# Altium schematic sheet 08_SAMA7G54-MPU.SchDoc
size 420 x 297 mm; SheetNumber: 13; SheetTotal: 36
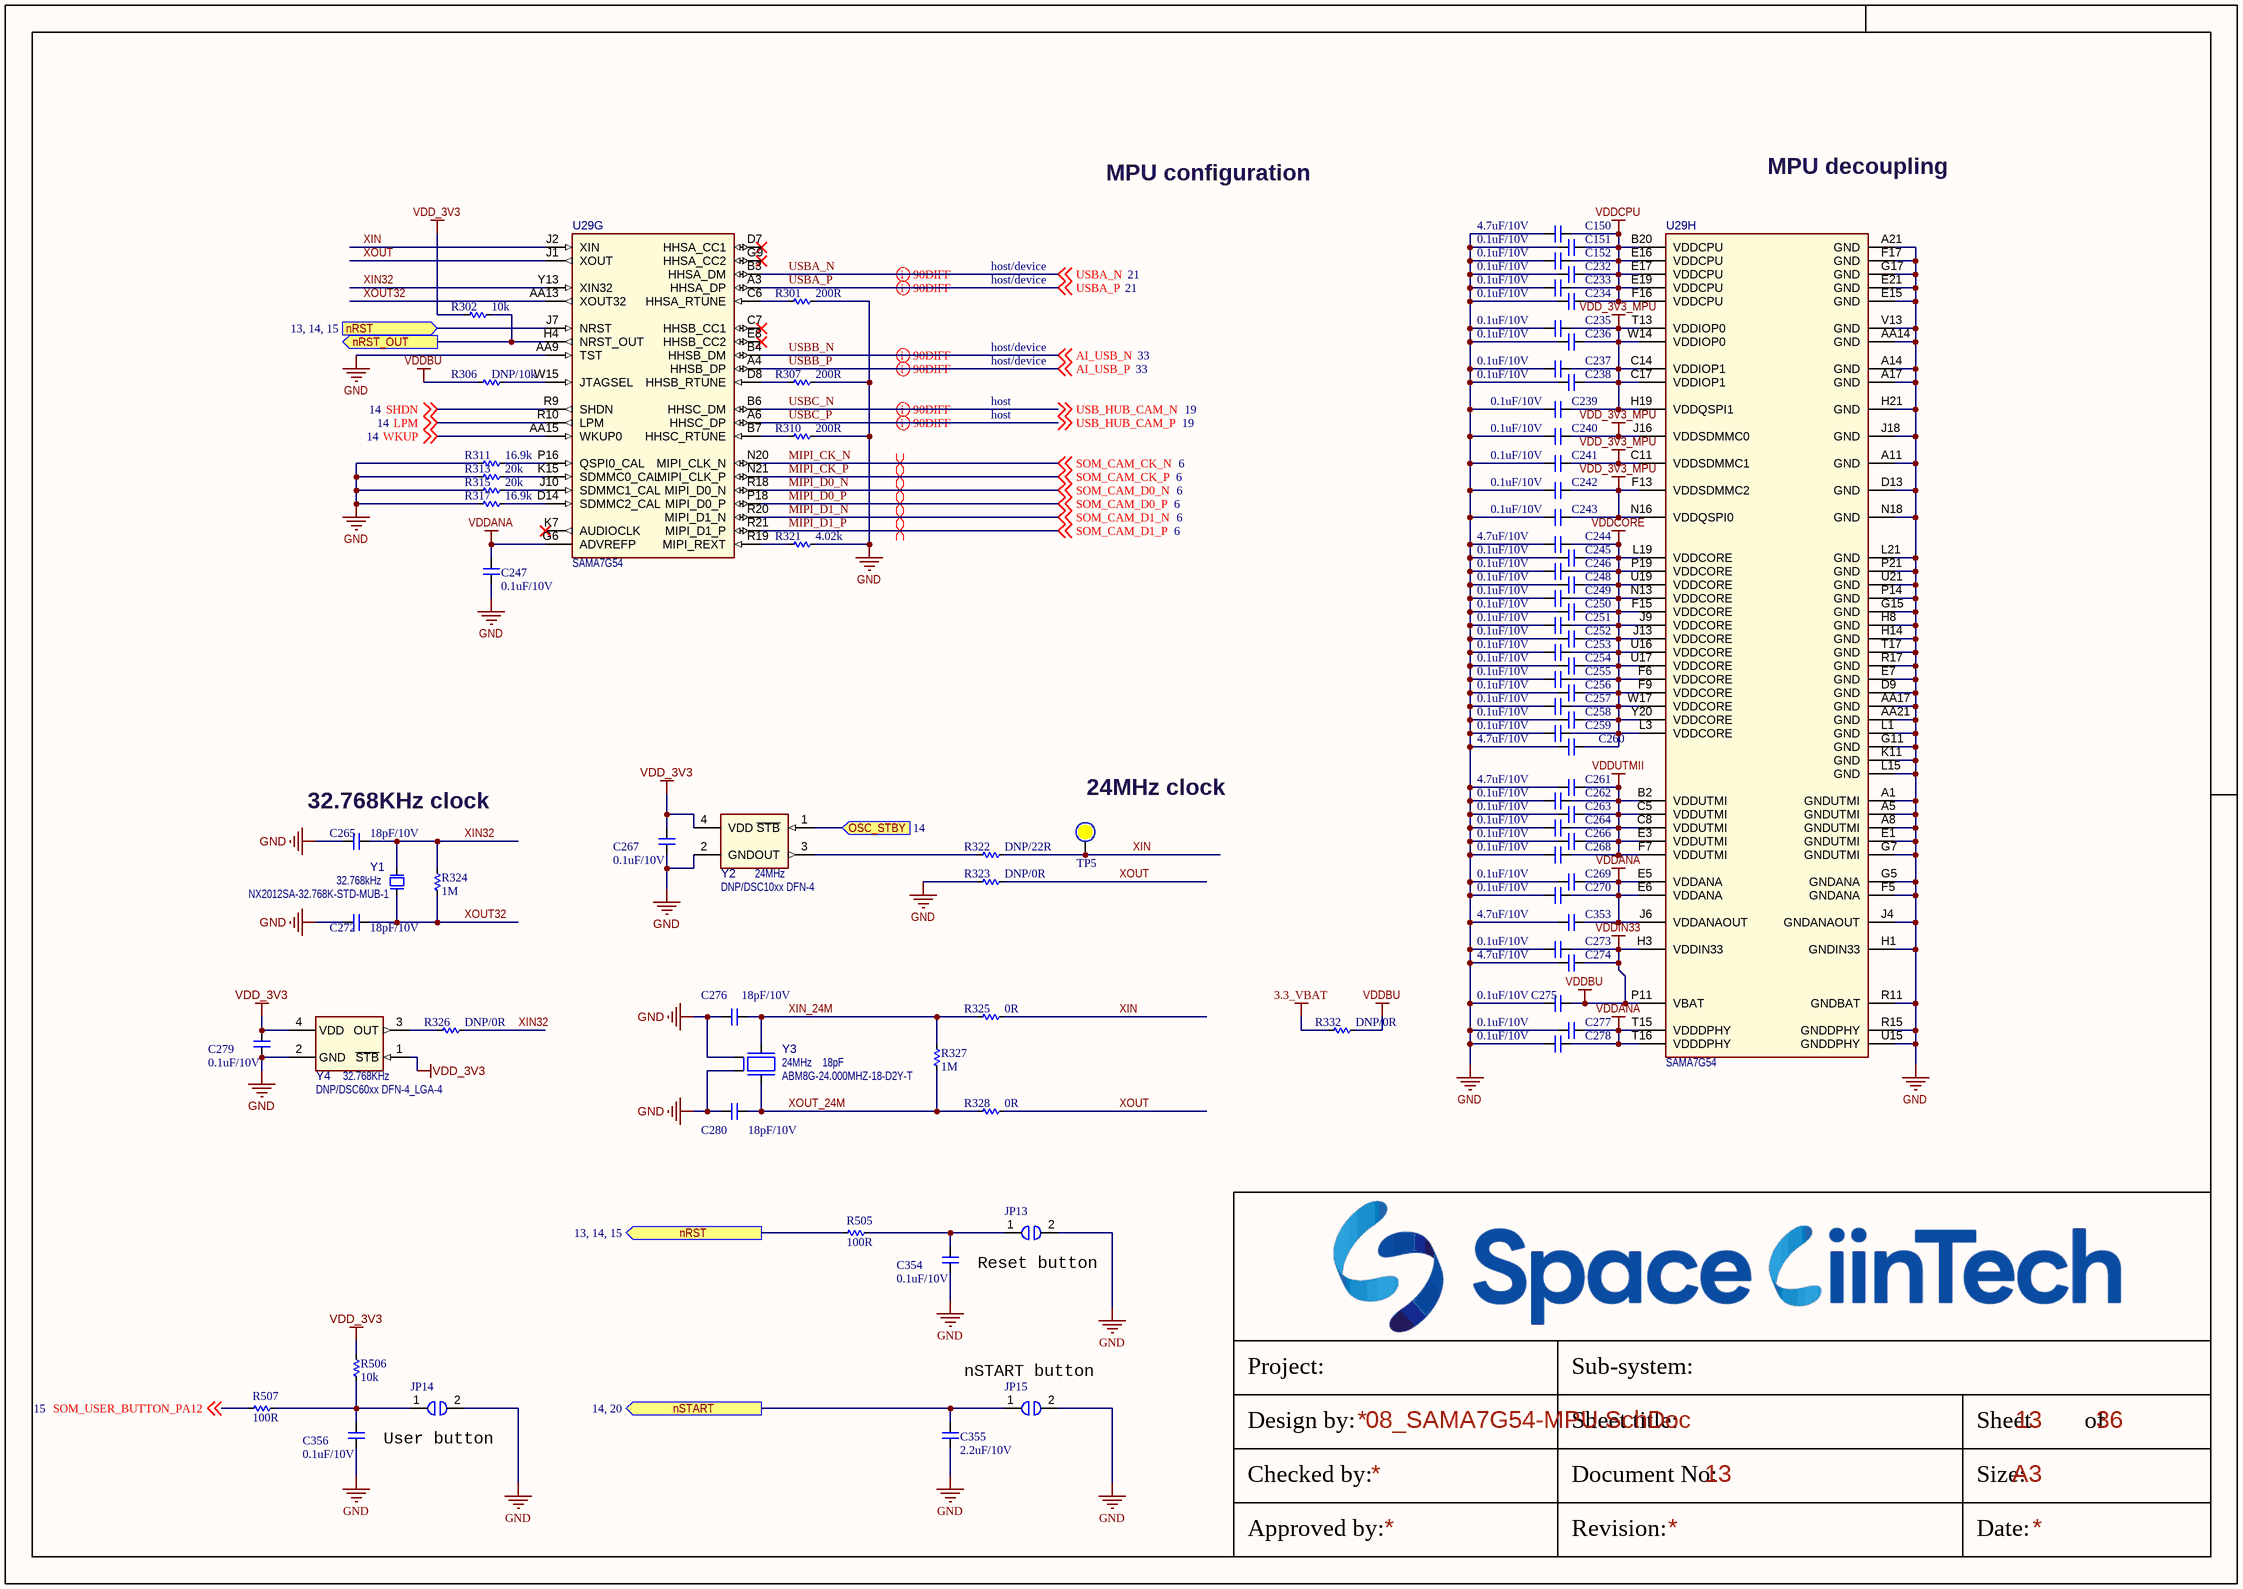
[diagram p0: 08_SAMA7G54-MPU.SchDoc]

## Parts
C150  4.7uF/10V  [CAP_C_1005X50_L]
C151  0.1uF/10V  [CAP_C_0603x30]
C152  0.1uF/10V  [CAP_C_0603x30]
C232  0.1uF/10V  [CAP_C_0603x30]
C233  0.1uF/10V  [CAP_C_0603x30]
C234  0.1uF/10V  [CAP_C_0603x30]
C235  0.1uF/10V  [CAP_C_0603x30]
C236  0.1uF/10V  [CAP_C_0603x30]
C237  0.1uF/10V  [CAP_C_0603x30]
C238  0.1uF/10V  [CAP_C_0603x30]
C239  0.1uF/10V  [CAP_C_0603x30]
C240  0.1uF/10V  [CAP_C_0603x30]
C241  0.1uF/10V  [CAP_C_0603x30]
C242  0.1uF/10V  [CAP_C_0603x30]
C243  0.1uF/10V  [CAP_C_0603x30]
C244  4.7uF/10V  [CAP_C_1005X50_L]
C245  0.1uF/10V  [CAP_C_0603x30]
C246  0.1uF/10V  [CAP_C_0603x30]
C247  0.1uF/10V  [CAP_C_0603x30]
C248  0.1uF/10V  [CAP_C_0603x30]
C249  0.1uF/10V  [CAP_C_0603x30]
C250  0.1uF/10V  [CAP_C_0603x30]
C251  0.1uF/10V  [CAP_C_0603x30]
C252  0.1uF/10V  [CAP_C_0603x30]
C253  0.1uF/10V  [CAP_C_0603x30]
C254  0.1uF/10V  [CAP_C_0603x30]
C255  0.1uF/10V  [CAP_C_0603x30]
C256  0.1uF/10V  [CAP_C_0603x30]
C257  0.1uF/10V  [CAP_C_0603x30]
C258  0.1uF/10V  [CAP_C_0603x30]
C259  0.1uF/10V  [CAP_C_0603x30]
C260  4.7uF/10V  [CAP_C_1005X50_L]
C261  4.7uF/10V  [CAP_C_1005X50_L]
C262  0.1uF/10V  [CAP_C_0603x30]
C263  0.1uF/10V  [CAP_C_0603x30]
C264  0.1uF/10V  [CAP_C_0603x30]
C265  18pF/10V  [CAP_C_1005X60]
C266  0.1uF/10V  [CAP_C_0603x30]
C267  0.1uF/10V  [CAP_C_1005X60]
C268  0.1uF/10V  [CAP_C_0603x30]
C269  0.1uF/10V  [CAP_C_0603x30]
C270  0.1uF/10V  [CAP_C_0603x30]
C272  18pF/10V  [CAP_C_1005X60]
C273  0.1uF/10V  [CAP_C_0603x30]
C274  4.7uF/10V  [CAP_C_1005X50_L]
C275  0.1uF/10V  [CAP_C_0603x30]
C276  18pF/10V  [CAP_C_1005X60]
C277  0.1uF/10V  [CAP_C_0603x30]
C278  0.1uF/10V  [CAP_C_0603x30]
C279  0.1uF/10V  [CAP_C_1005X60]
C280  18pF/10V  [CAP_C_1005X60]
C353  4.7uF/10V  [CAP_C_1005X50_L]
C354  0.1uF/10V  [CAP_C_1005X60]
C355  2.2uF/10V  [CAP_C_1005X60]
C356  0.1uF/10V  [CAP_C_1005X60]
JP13  (no value)  [TESTPOINT_SHORT_120X100_60]
JP14  (no value)  [TESTPOINT_SHORT_120X100_60]
JP15  (no value)  [TESTPOINT_SHORT_120X100_60]
R301  200R  [RES_C_0603X30]
R302  10k  [RES_C_1005X40]
R306  DNP/10k  [RES_C_0603X30]
R307  200R  [RES_C_0603X30]
R310  200R  [RES_C_0603X30]
R311  16.9k  [RES_C_0603X30]
R313  20k  [RES_C_1005X40]
R315  20k  [RES_C_0603X30]
R317  16.9k  [RES_C_0603X30]
R321  4.02k  [RES_C_1005X40]
R322  DNP/22R  [RES_C_1005X40]
R323  DNP/0R  [RES_C_1005X40]
R324  1M  [RES_C_1005X40]
R325  0R  [RES_C_1005X40]
R326  DNP/0R  [RES_C_1005X40]
R327  1M  [RES_C_1005X40]
R328  0R  [RES_C_1005X40]
R332  DNP/0R  [RES_C_1005X40]
R505  100R  [RES_C_1005X40]
R506  10k  [RES_C_1005X40]
R507  100R  [RES_C_1005X40]
TP5  (no value)  [Testpoint_80]  (no BOM)
U29  SAMA7G54  [TFBGA-343_14x14 - 2.5mm]  (parts G,H of 8)
Y1  value 32.768kHz  Manufacturer Part Number 1: NX2012SA-32.768K-STD-MUB-1  [CRYSTAL_NX2012SA]  (hidden comment: Crystal 2 Pins)
Y2  DNP/DSC10xx DFN-4  value 24MHz  [DFN-4_2.5x2]
Y3  value 24MHz  Load Capacitance: 18pF  Manufacturer Part Number 1: ABM8G-24.000MHZ-18-D2Y-T  [CRYSTAL_ABM8G]  (hidden comment: Crystal 4 Pins)
Y4  DNP/DSC60xx DFN-4_LGA-4  value 32.768KHz  [DFN-4_2x1.6]

## Ports
nRST (in, see 13, 14, 15), nRST (out, see 13, 14, 15), nRST_OUT (out), nSTART (out, see 14, 20), OSC_STBY (in, see 14)

## Nets
3.3_VBAT: R332.1
GND: C150.2 C151.2 C152.2 C232.2 C233.2 C234.2 C235.2 C236.2 C237.2 C238.2 C239.2 C240.2 C241.2 C242.2 C243.2 C244.2 C245.2 C246.2 C247.1 C248.2 C249.2 C250.2 C251.2 C252.2 C253.2 C254.2 C255.2 C256.2 C257.2 C258.2 C259.2 C260.2 C261.2 C262.2 C263.2 C264.2 C265.2 C266.2 C267.1 C268.2 C269.2 C270.2 C272.2 C273.2 C274.2 C275.2 C276.2 C277.2 C278.2 C279.1 C280.2 C353.2 C354.1 C355.2 C356.1 JP13.2 JP14.2 JP15.2 R301.1 R307.1 R310.1 R311.2 R313.2 R315.2 R317.2 R321.1 R323.1 U29.A1(GNDUTMI) U29.A5(GNDUTMI) U29.A8(GNDUTMI) U29.A11(GND) U29.A14(GND) U29.A17(GND) U29.A21(GND) U29.AA9(TST) U29.AA14(GND) U29.AA17(GND) U29.AA21(GND) U29.D9(GND) U29.D13(GND) U29.E1(GNDUTMI) U29.E7(GND) U29.E15(GND) U29.E21(GND) U29.F5(GNDANA) U29.F17(GND) U29.G5(GNDANA) U29.G7(GNDUTMI) U29.G11(GND) U29.G15(GND) U29.G17(GND) U29.H1(GNDIN33) U29.H8(GND) U29.H14(GND) U29.H21(GND) U29.J4(GNDANAOUT) U29.J18(GND) U29.K11(GND) U29.L1(GND) U29.L15(GND) U29.L21(GND) U29.N18(GND) U29.P14(GND) U29.P21(GND) U29.R11(GNDBAT) U29.R15(GNDDPHY) U29.R17(GND) U29.T17(GND) U29.U15(GNDDPHY) U29.U21(GND) U29.V13(GND) Y2.2(GND) Y3.2(GND) Y3.4(GND) Y4.2(GND)
VDD_3V3: C267.2 C279.2 R302.2 R506.2 Y2.4(VDD) Y4.1(~{STB}) Y4.4(VDD)
VDD_3V3_MPU: C235.1 C236.1 C237.1 C238.1 C239.1 C240.1 C241.1 C242.1 C243.1 U29.C11(VDDSDMMC1) U29.C14(VDDIOP1) U29.C17(VDDIOP1) U29.F13(VDDSDMMC2) U29.H19(VDDQSPI1) U29.J16(VDDSDMMC0) U29.N16(VDDQSPI0) U29.T13(VDDIOP0) U29.W14(VDDIOP0)
VDDANA: C247.2 C269.1 C270.1 C277.1 C278.1 C353.1 U29.E5(VDDANA) U29.E6(VDDANA) U29.G6(ADVREFP) U29.J6(VDDANAOUT) U29.T15(VDDDPHY) U29.T16(VDDDPHY)
VDDBU: C273.1 C274.1 C275.1 R306.2 R332.2 U29.H3(VDDIN33) U29.P11(VBAT)  [also labelled VDDIN33]
VDDCORE: C244.1 C245.1 C246.1 C248.1 C249.1 C250.1 C251.1 C252.1 C253.1 C254.1 C255.1 C256.1 C257.1 C258.1 C259.1 C260.1 U29.F6(VDDCORE) U29.F9(VDDCORE) U29.F15(VDDCORE) U29.J9(VDDCORE) U29.J13(VDDCORE) U29.L3(VDDCORE) U29.L19(VDDCORE) U29.N13(VDDCORE) U29.P19(VDDCORE) U29.U16(VDDCORE) U29.U17(VDDCORE) U29.U19(VDDCORE) U29.W17(VDDCORE) U29.Y20(VDDCORE)
VDDCPU: C150.1 C151.1 C152.1 C232.1 C233.1 C234.1 U29.B20(VDDCPU) U29.E16(VDDCPU) U29.E17(VDDCPU) U29.E19(VDDCPU) U29.F16(VDDCPU)
VDDUTMII: C261.1 C262.1 C263.1 C264.1 C266.1 C268.1 U29.B2(VDDUTMI) U29.C5(VDDUTMI) U29.C8(VDDUTMI) U29.E3(VDDUTMI) U29.F7(VDDUTMI)
LPM: U29.R10(LPM) ; off-sheet LPM
MIPI_CK_N: U29.N20(MIPI_CLK_N) ; off-sheet SOM_CAM_CK_N  [also labelled SOM_CAM_CK_N]
MIPI_CK_P: U29.N21(MIPI_CLK_P) ; off-sheet SOM_CAM_CK_P  [also labelled SOM_CAM_CK_P]
MIPI_D0_N: U29.R18(MIPI_D0_N) ; off-sheet SOM_CAM_D0_N  [also labelled SOM_CAM_D0_N]
MIPI_D0_P: U29.P18(MIPI_D0_P) ; off-sheet SOM_CAM_D0_P  [also labelled SOM_CAM_D0_P]
MIPI_D1_N: U29.R20(MIPI_D1_N) ; off-sheet SOM_CAM_D1_N  [also labelled SOM_CAM_D1_N]
MIPI_D1_P: U29.R21(MIPI_D1_P) ; off-sheet SOM_CAM_D1_P  [also labelled SOM_CAM_D1_P]
nRST: R505.1 U29.J7(NRST) ; port nRST
nRST_OUT: R302.1 U29.H4(NRST_OUT) ; port nRST_OUT
nSTART: C355.1 JP15.1 ; port nSTART
OSC_STBY: Y2.1(~{STB}) ; port OSC_STBY
SHDN: U29.R9(SHDN) ; off-sheet SHDN
SOM_USER_BUTTON_PA12: R507.1 ; off-sheet SOM_USER_BUTTON_PA12
USBA_N: U29.B3(HHSA_DM) ; off-sheet USBA_N
USBA_P: U29.A3(HHSA_DP) ; off-sheet USBA_P
USBB_N: U29.B4(HHSB_DM) ; off-sheet AI_USB_N  [also labelled AI_USB_N]
USBB_P: U29.A4(HHSB_DP) ; off-sheet AI_USB_P  [also labelled AI_USB_P]
USBC_N: U29.B6(HHSC_DM) ; off-sheet USB_HUB_CAM_N  [also labelled USB_HUB_CAM_N]
USBC_P: U29.A6(HHSC_DP) ; off-sheet USB_HUB_CAM_P  [also labelled USB_HUB_CAM_P]
WKUP: U29.AA15(WKUP0) ; off-sheet WKUP
XIN: R322.2 R325.2 TP5.1 U29.J2(XIN)
XIN32: C265.1 R324.1 R326.2 U29.Y13(XIN32) Y1.2(Osc2)
XIN_24M: C276.1 R325.1 R327.2 Y3.3(Osc2)
XOUT: R323.2 R328.2 U29.J1(XOUT)
XOUT32: C272.1 R324.2 U29.AA13(XOUT32) Y1.1(Osc1)
XOUT_24M: C280.1 R327.1 R328.1 Y3.1(Osc1)
NetC354_2: C354.2 JP13.1 R505.2
NetC356_2: C356.2 JP14.1 R506.1 R507.2
NetR301_2: R301.2 U29.C6(HHSA_RTUNE)
NetR306_1: R306.1 U29.W15(JTAGSEL)
NetR307_2: R307.2 U29.D8(HHSB_RTUNE)
NetR310_2: R310.2 U29.B7(HHSC_RTUNE)
NetR311_1: R311.1 U29.P16(QSPI0_CAL)
NetR313_1: R313.1 U29.K15(SDMMC0_CAL)
NetR315_1: R315.1 U29.J10(SDMMC1_CAL)
NetR317_1: R317.1 U29.D14(SDMMC2_CAL)
NetR321_2: R321.2 U29.R19(MIPI_REXT)
NetR322_1: R322.1 Y2.3(OUT)
NetR326_1: R326.1 Y4.3(OUT)

Not connected (* = marked no-connect by the designer): U29 C7(HHSB_CC1)* D7(HHSA_CC1)* E8(HHSB_CC2)* G9(HHSA_CC2)* K7(AUDIOCLK)*

## Layout directives
differential pair; differential pair class DIFF90; net class DIFF90: USBA_N, USBA_P, USBB_N, USBB_P, USBC_N, USBC_P
differential pair; net class DIFF100; differential pair class DIFF100: MIPI_CK_N, MIPI_CK_P, MIPI_D0_N, MIPI_D0_P, MIPI_D1_N, MIPI_D1_P

## Notes on the sheet
- MPU configuration
- MPU decoupling
- host/device
- host
- (near C265) 32.768KHz clock
- (near TP5) 24MHz clock
- Reset button
- (near JP15) nSTART button
- User button
- Project:
- Sub-system:
- Design by:
- Sheet title:
- Sheet
- of
- Checked by:
- Approved by:
- Revision:
- Document No:
- Size:
- Date:
- A3

## Library data of the parts
C150-C152 C232-C270 C272-C280 = _CAP_C_2: CAP
C353-C356 = _CAP_C_2: CAP CHIP
JP13-JP15 = JUMPER_1_1
R301 R302 R306 R307 R310 R311 R313 R315 R317 R321-R328 R332 R505-R507 = _RES_B_2: RES
TP5 = Test Point: Solder: NF
U29 = SAMA7G54: SAMA7G54 MPU 1000MHz Cortex-A7 TFBGA-343; Manufacturer Part Number 1: SAMA7G54-V/4HB; Manufacturer 1: Microchip; Description_: MCHP MPU 32-BIT Cortex-A7 1000MHz 128kB SAMA7G54-V/4HB TFBGA-343; Populated: YES; MCHP-ID: MIC8923; Symbol: SAMA7G54 TFBGA-343; Dev Tools Status: Design; Owner: Ciprian Abramov; Package: TFBGA-343; Value: SAMA7G54; Type: 32-Bit MPU; Status: MCL Design; Revision: 1; Category: MCHP-Microcontroller; ComponentLink1Description: SVN Datasheet; ComponentLink2Description: Local Datasheet; ComponentLink3URL: C:\ALTIUM_WORK\00001_MCHP-CDB\Library\LibraryRefs\SAMA7G54 TFBGA-343.SchLib; ComponentLink3Description: Open Symbol; ComponentLink4URL: C:\ALTIUM_WORK\00001_MCHP-CDB\Library\Footprints\TFBGA-343_14x14.PcbLib; ComponentLink4Description: Open Footprint; ComponentLink5Description: Open Footprint 2; ComponentLink6Description: Open Footprint 3; ComponentLink7Description: Open Footprint 4; Supplier 1: Microchip; Supplier Part Number 1: SAMA7G54-V/4HB; Quantity Override: 1
Y1 = OSC_32.768kHz: Crystal; Manufacturer 1: NDK; MCHP-ID: OSC1092; Description_: CRYSTAL 32.768kHz 12.5pF SMD NX2012SA; Dev Tools Status: Production; Owner: Jamus Griego; Tolerance: ±20ppm; Load Capacitance: 12.5pF; Populated: YES; Revision: 1; Symbol: Crystal 2 Pins; Status: MCL Design; ComponentLink1URL: https://chn-vm-apps.microchip.com/mchprepo/parts/Datasheets/c_NX2012SA-STD-MUB-1_e.pdf; ComponentLink1Description: SVN Datasheet; ComponentLink2URL: C:\ALTIUM_WORK\00001_MCHP-CDB\Datasheets\c_NX2012SA-STD-MUB-1_e.pdf; ComponentLink2Description: Local Datasheet; ComponentLink3URL: C:\ALTIUM_WORK\00001_MCHP-CDB\Library\LibraryRefs\Crystal 2 Pins.SchLib; ComponentLink3Description: Open Symbol; ComponentLink4URL: C:\ALTIUM_WORK\00001_MCHP-CDB\Library\Footprints\CRYSTAL_NX2012SA.PcbLib; ComponentLink4Description: Open Footprint; ComponentLink5Description: Open Footprint 2; ComponentLink6Description: Open Footprint 3; ComponentLink7Description: Open Footprint 4; Type: Crystal; Category: Crystal/Oscillator; Supplier 1: Digi-Key; Supplier Part Number 1: 644-1219-1-ND; Quantity Override: 1
Y2 = MIC6659: Manufacturer 1: Microchip Technology; Manufacturer Part Number 1: DSC1001DI5-024.0000T; Description_: MCHP CLOCK OSCILLATOR SINGLE 24MHz DSC1001DI5-024.0000 SMD-2520; Dev Tools Status: Design; Owner: Maurizio Gavardoni; Populated: YES; MCHP-ID: MIC6659; Revision: A; Symbol: DSC10xx DFN-4; Status: MCL Design; ComponentLink1Description: SVN Datasheet; ComponentLink2Description: Local Datasheet; ComponentLink3URL: C:\ALTIUM_WORK\00001_MCHP-CDB\Library\LibraryRefs\DSC10xx DFN-4.SchLib; ComponentLink3Description: Open Symbol; ComponentLink4URL: C:\ALTIUM_WORK\00001_MCHP-CDB\Library\Footprints\DFN-4_2.5x2.PcbLib; ComponentLink4Description: Open Footprint; ComponentLink5Description: Open Footprint 2; ComponentLink6Description: Open Footprint 3; ComponentLink7Description: Open Footprint 4; Category: MCHP-Clock/Timing; Type: Oscillator; Supplier 1: Digi-Key; Supplier Part Number 1: DSC1001DI5-024.0000T-ND; Quantity Override: 1
Y3 = OSC_24MHz: Crystal; Manufacturer 1: Abracon Corporation; MCHP-ID: OSC1047; Description_: CRYSTAL 24MHz 18pF SMD ABM8G; Dev Tools Status: Production; Owner: Mark Loper; Populated: DNP; Revision: 1; Symbol: Crystal 4 Pins; Status: MCL Design; ComponentLink1URL: https://chn-vm-apps.microchip.com/mchprepo/parts/Datasheets/ABM8G.pdf; ComponentLink1Description: SVN Datasheet; ComponentLink2URL: C:\ALTIUM_WORK\00001_MCHP-CDB\Datasheets\ABM8G.pdf; ComponentLink2Description: Local Datasheet; ComponentLink3URL: C:\ALTIUM_WORK\00001_MCHP-CDB\Library\LibraryRefs\Crystal 4 Pins.SchLib; ComponentLink3Description: Open Symbol; ComponentLink4URL: C:\ALTIUM_WORK\00001_MCHP-CDB\Library\Footprints\CRYSTAL_ABM8G.PcbLib; ComponentLink4Description: Open Footprint; ComponentLink5Description: Open Footprint 2; ComponentLink6Description: Open Footprint 3; ComponentLink7Description: Open Footprint 4; Package: ABM8G; Type: Crystal; Category: Crystal/Oscillator; Supplier 1: Digi-Key; Supplier Part Number 1: 535-10273-1-ND; Quantity Override: 1
Y4 = MIC8888: Manufacturer 1: Microchip Technology; Manufacturer Part Number 1: DSC6003MA3B-032K768; Description_: MCHP CLOCK OSCILLATOR SINGLE 32.768KHz DSC6003MA3B-032K768 SMD DFN-4; Dev Tools Status: Design; Owner: Ciprian Abramov; Populated: DNP; MCHP-ID: MIC8888; Revision: 1; Symbol: DSC60xx DFN-4_LGA-4; Status: MCL Design; ComponentLink1Description: SVN Datasheet; ComponentLink2Description: Local Datasheet; ComponentLink3URL: C:\ALTIUM_WORK\00001_MCHP-CDB\Library\LibraryRefs\DSC60xx DFN-4_LGA-4.SchLib; ComponentLink3Description: Open Symbol; ComponentLink4URL: C:\ALTIUM_WORK\00001_MCHP-CDB\Library\Footprints\DFN-4_2x1.6.PcbLib; ComponentLink4Description: Open Footprint; ComponentLink5Description: Open Footprint 2; ComponentLink6Description: Open Footprint 3; ComponentLink7Description: Open Footprint 4; Category: MCHP-Clock/Timing; Type: Oscillator; Supplier 1: Digi-Key; Supplier Part Number 1: DSC6003MA3B-032K768-ND; Quantity Override: 1; Supplier 2: Mouser; Supplier Part Number 2: 579-6003MA3B032K768